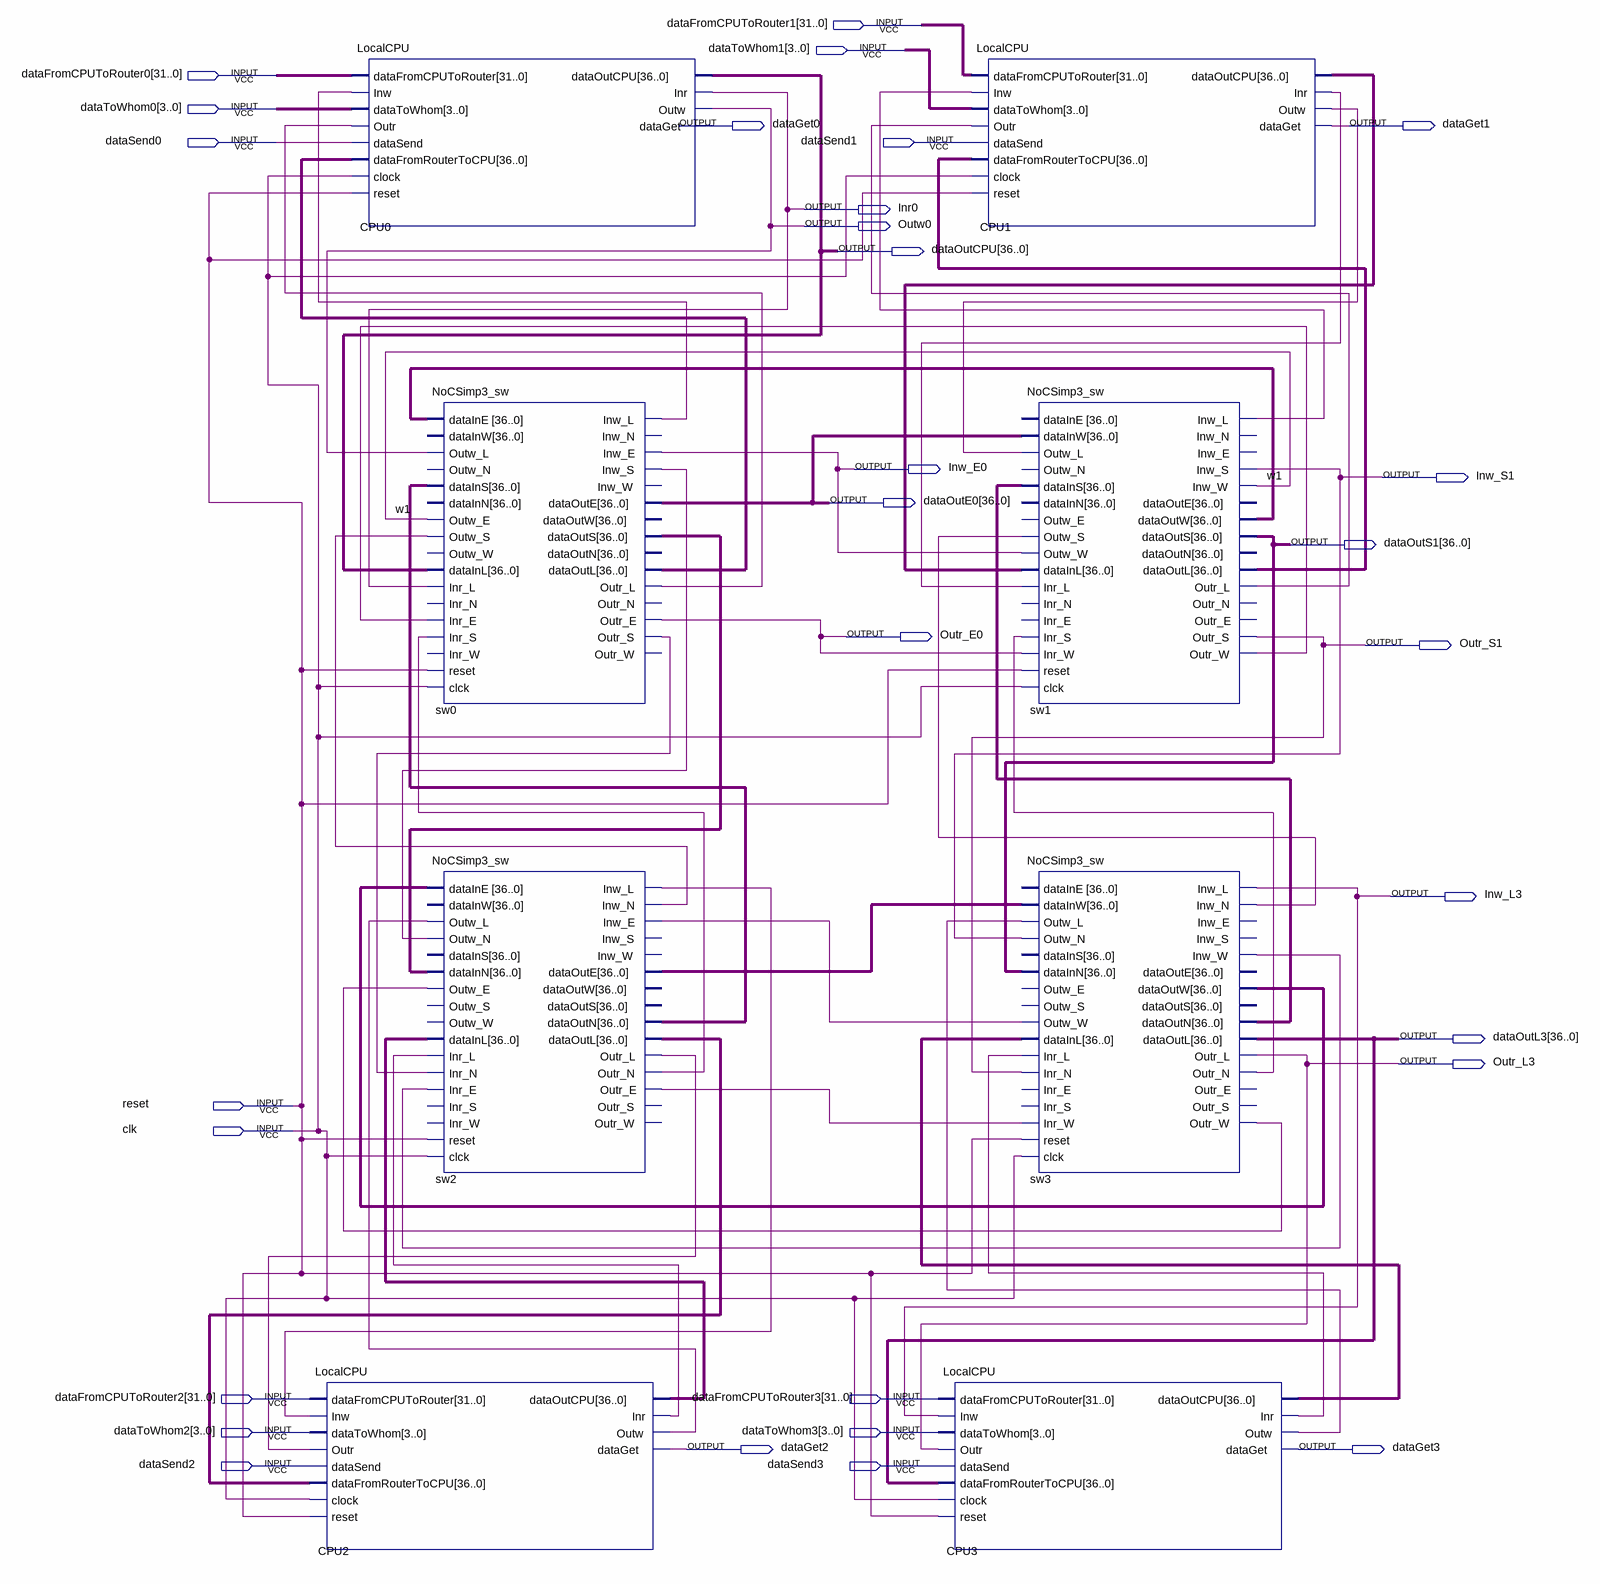
[diagram p0: schematic sheet]
// Quartus schematic 4sw_1.bdf as structural Verilog: 8 symbols, 30 pins
module \4sw_1  (
  input  [31:0] dataFromCPUToRouter1,
  input  [3:0] dataToWhom1,
  input  [31:0] dataFromCPUToRouter0,
  input  [3:0] dataToWhom0,
  input  dataSend0,
  input  dataSend1,
  input  reset,
  input  clk,
  input  [31:0] dataFromCPUToRouter2,
  input  [31:0] dataFromCPUToRouter3,
  input  [3:0] dataToWhom2,
  input  [3:0] dataToWhom3,
  input  dataSend2,
  input  dataSend3,
  output dataGet0,
  output dataGet1,
  output Inr0,
  output Outw0,
  output [36:0] dataOutCPU,
  output Inw_E0,
  output Inw_S1,
  output [36:0] dataOutE0,
  output [36:0] dataOutS1,
  output Outr_E0,
  output Outr_S1,
  output Inw_L3,
  output [36:0] dataOutL3,
  output Outr_L3,
  output dataGet2,
  output dataGet3
);

  wire CPU1_inr, CPU1_outw, CPU2_inr, CPU2_outw, CPU3_inr, CPU3_outw, sw0_inw_l, sw0_inw_s, sw0_outr_l,
       sw0_outr_s, sw1_inw_l, sw1_outr_l, sw1_outr_w, sw2_inw_e, sw2_inw_l, sw2_inw_n, sw2_outr_e,
       sw2_outr_l, sw2_outr_n, sw3_inw_n, sw3_inw_w, sw3_outr_n, sw3_outr_w, w1;
  wire [36:0] CPU1_dataoutcpu, CPU2_dataoutcpu, CPU3_dataoutcpu, sw0_dataoutl, sw0_dataouts, sw1_dataoutl,
       sw1_dataoutw, sw2_dataoute, sw2_dataoutl, sw2_dataoutn, sw3_dataoutn, sw3_dataoutw;

  LocalCPU CPU0 (
    .dataFromCPUToRouter(dataFromCPUToRouter0), .Inw(sw0_inw_l), .dataToWhom(dataToWhom0), .Outr(sw0_outr_l),
    .dataSend(dataSend0), .dataFromRouterToCPU(sw0_dataoutl), .clock(clk), .reset(reset),
    .dataOutCPU(dataOutCPU), .Inr(Inr0), .Outw(Outw0));  // open: dataGet
  LocalCPU CPU2 (
    .dataFromCPUToRouter(dataFromCPUToRouter2), .Inw(sw2_inw_l), .dataToWhom(dataToWhom2), .Outr(sw2_outr_l),
    .dataSend(dataSend2), .dataFromRouterToCPU(sw2_dataoutl), .clock(clk), .reset(reset),
    .dataOutCPU(CPU2_dataoutcpu), .Inr(CPU2_inr), .Outw(CPU2_outw), .dataGet(dataGet2));
  NoCSimp3_sw sw0 (
    .dataInE(sw1_dataoutw), .Outw_L(Outw0), .dataInS(sw2_dataoutn), .Outw_E(w1), .Outw_S(sw2_inw_n),
    .dataInL(dataOutCPU), .Inr_L(Inr0), .Inr_E(sw1_outr_w), .Inr_S(sw2_outr_n), .reset(reset), .clck(clk),
    .Inw_L(sw0_inw_l), .Inw_E(Inw_E0), .Inw_S(sw0_inw_s), .dataOutE(dataOutE0), .dataOutS(sw0_dataouts),
    .dataOutL(sw0_dataoutl), .Outr_L(sw0_outr_l), .Outr_E(Outr_E0), .Outr_S(sw0_outr_s));  // open: dataInW, Outw_N, dataInN, Outw_W, Inr_N, Inr_W, Inw_N, Inw_W, dataOutW, dataOutN, Outr_N, Outr_W
  NoCSimp3_sw sw2 (
    .dataInE(sw3_dataoutw), .Outw_L(CPU2_outw), .Outw_N(sw0_inw_s), .dataInN(sw0_dataouts),
    .Outw_E(sw3_outr_w), .dataInL(CPU2_dataoutcpu), .Inr_L(CPU2_inr), .Inr_N(sw0_outr_s), .Inr_E(sw3_inw_w),
    .reset(reset), .clck(clk), .Inw_L(sw2_inw_l), .Inw_N(sw2_inw_n), .Inw_E(sw2_inw_e),
    .dataOutE(sw2_dataoute), .dataOutN(sw2_dataoutn), .dataOutL(sw2_dataoutl), .Outr_L(sw2_outr_l),
    .Outr_N(sw2_outr_n), .Outr_E(sw2_outr_e));  // open: dataInW, dataInS, Outw_S, Outw_W, Inr_S, Inr_W, Inw_S, Inw_W, dataOutW, dataOutS, Outr_S, Outr_W
  LocalCPU CPU1 (
    .dataFromCPUToRouter(dataFromCPUToRouter1), .Inw(sw1_inw_l), .dataToWhom(dataToWhom1), .Outr(sw1_outr_l),
    .dataSend(dataSend1), .dataFromRouterToCPU(sw1_dataoutl), .clock(clk), .reset(reset),
    .dataOutCPU(CPU1_dataoutcpu), .Inr(CPU1_inr), .Outw(CPU1_outw), .dataGet(dataGet1));
  LocalCPU CPU3 (
    .dataFromCPUToRouter(dataFromCPUToRouter3), .Inw(Inw_L3), .dataToWhom(dataToWhom3), .Outr(Outr_L3),
    .dataSend(dataSend3), .dataFromRouterToCPU(dataOutL3), .clock(clk), .reset(reset),
    .dataOutCPU(CPU3_dataoutcpu), .Inr(CPU3_inr), .Outw(CPU3_outw), .dataGet(dataGet3));
  NoCSimp3_sw sw1 (
    .dataInW(dataOutE0), .Outw_L(CPU1_outw), .dataInS(sw3_dataoutn), .Outw_S(sw3_inw_n), .Outw_W(Inw_E0),
    .dataInL(CPU1_dataoutcpu), .Inr_L(CPU1_inr), .Inr_S(sw3_outr_n), .Inr_W(Outr_E0), .reset(reset),
    .clck(clk), .Inw_L(sw1_inw_l), .Inw_S(Inw_S1), .Inw_W(w1), .dataOutW(sw1_dataoutw), .dataOutS(dataOutS1),
    .dataOutL(sw1_dataoutl), .Outr_L(sw1_outr_l), .Outr_S(Outr_S1), .Outr_W(sw1_outr_w));  // open: dataInE, Outw_N, dataInN, Outw_E, Inr_N, Inr_E, Inw_N, Inw_E, dataOutE, dataOutN, Outr_N, Outr_E
  NoCSimp3_sw sw3 (
    .dataInW(sw2_dataoute), .Outw_L(CPU3_outw), .Outw_N(Inw_S1), .dataInN(dataOutS1), .Outw_W(sw2_inw_e),
    .dataInL(CPU3_dataoutcpu), .Inr_L(CPU3_inr), .Inr_N(Outr_S1), .Inr_W(sw2_outr_e), .reset(reset),
    .clck(clk), .Inw_L(Inw_L3), .Inw_N(sw3_inw_n), .Inw_W(sw3_inw_w), .dataOutW(sw3_dataoutw),
    .dataOutN(sw3_dataoutn), .dataOutL(dataOutL3), .Outr_L(Outr_L3), .Outr_N(sw3_outr_n), .Outr_W(sw3_outr_w));  // open: dataInE, dataInS, Outw_E, Outw_S, Inr_E, Inr_S, Inw_E, Inw_S, dataOutE, dataOutS, Outr_E, Outr_S
endmodule
